# Altium project MCH_MAIN.PrjPcb (part 3 of 3)

## Sheet MB_ZBT_memory.SchDoc
size A
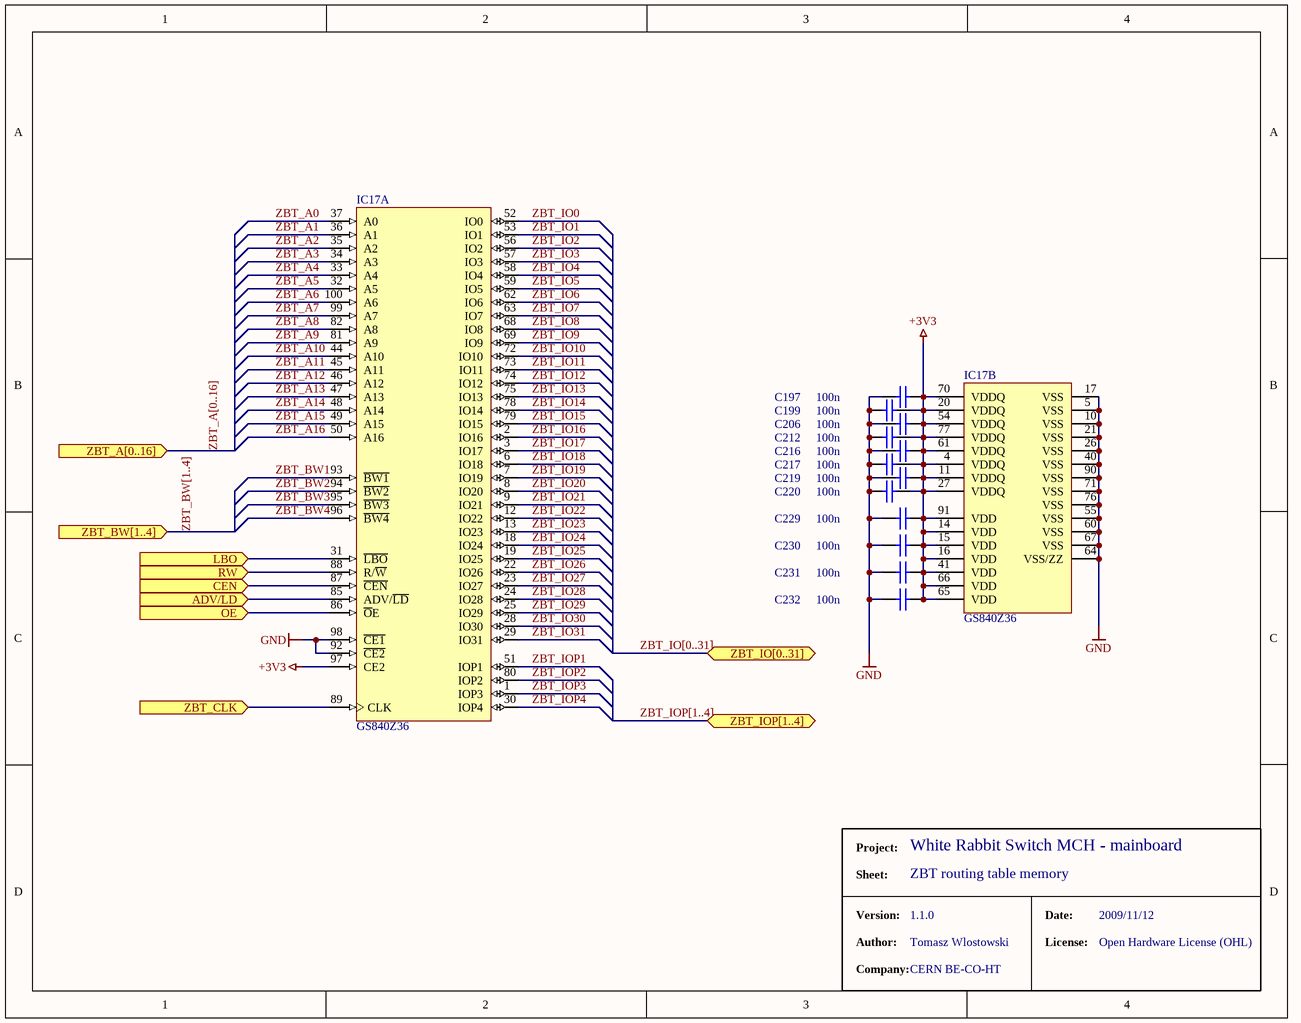
[diagram p7: MB_ZBT_memory.SchDoc]

### Parts
C197  100n  [CAPC1005X55N]
C199  100n  [CAPC1005X55N]
C206  100n  [CAPC1005X55N]
C212  100n  [CAPC1005X55N]
C216  100n  [CAPC1005X55N]
C217  100n  [CAPC1005X55N]
C219  100n  [CAPC1005X55N]
C220  100n  [CAPC1005X55N]
C229  100n  [CAPC1005X55N]
C230  100n  [CAPC1005X55N]
C231  100n  [CAPC1005X55N]
C232  100n  [CAPC1005X55N]
IC17  GS840Z36  [TQFP100A101]  (parts A,B of 2)

### Ports
ADV/LD (in), CEN (in), LBO (in), OE (in), RW (in), ZBT_A[0..16] (in), ZBT_BW[1..4] (in), ZBT_CLK (in), ZBT_IO[0..31] (bidir), ZBT_IOP[1..4] (bidir)

### Nets
+3V3: C197.2 C199.2 C206.2 C212.2 C216.2 C217.2 C219.2 C220.2 C229.2 C230.2 C231.2 C232.2 IC17.4(VDDQ) IC17.11(VDDQ) IC17.14(VDD) IC17.15(VDD) IC17.16(VDD) IC17.20(VDDQ) IC17.27(VDDQ) IC17.41(VDD) IC17.54(VDDQ) IC17.61(VDDQ) IC17.65(VDD) IC17.66(VDD) IC17.70(VDDQ) IC17.77(VDDQ) IC17.91(VDD) IC17.97(CE2)
GND: C197.1 C199.1 C206.1 C212.1 C216.1 C217.1 C219.1 C220.1 C229.1 C230.1 C231.1 C232.1 IC17.5(VSS) IC17.10(VSS) IC17.17(VSS) IC17.21(VSS) IC17.26(VSS) IC17.40(VSS) IC17.55(VSS) IC17.60(VSS) IC17.64(VSS/ZZ) IC17.67(VSS) IC17.71(VSS) IC17.76(VSS) IC17.90(VSS) IC17.92(~{CE2}) IC17.98(~{CE1})
ZBT_A0: IC17.37(A0)
ZBT_A1: IC17.36(A1)
ZBT_A2: IC17.35(A2)
ZBT_A3: IC17.34(A3)
ZBT_A4: IC17.33(A4)
ZBT_A5: IC17.32(A5)
ZBT_A6: IC17.100(A6)
ZBT_A7: IC17.99(A7)
ZBT_A8: IC17.82(A8)
ZBT_A9: IC17.81(A9)
ZBT_A10: IC17.44(A10)
ZBT_A11: IC17.45(A11)
ZBT_A12: IC17.46(A12)
ZBT_A13: IC17.47(A13)
ZBT_A14: IC17.48(A14)
ZBT_A15: IC17.49(A15)
ZBT_A16: IC17.50(A16)
ZBT_BW1: IC17.93(~{BW1})
ZBT_BW2: IC17.94(~{BW2})
ZBT_BW3: IC17.95(~{BW3})
ZBT_BW4: IC17.96(~{BW4})
ZBT_IO0: IC17.52(IO0)
ZBT_IO1: IC17.53(IO1)
ZBT_IO2: IC17.56(IO2)
ZBT_IO3: IC17.57(IO3)
ZBT_IO4: IC17.58(IO4)
ZBT_IO5: IC17.59(IO5)
ZBT_IO6: IC17.62(IO6)
ZBT_IO7: IC17.63(IO7)
ZBT_IO8: IC17.68(IO8)
ZBT_IO9: IC17.69(IO9)
ZBT_IO10: IC17.72(IO10)
ZBT_IO11: IC17.73(IO11)
ZBT_IO12: IC17.74(IO12)
ZBT_IO13: IC17.75(IO13)
ZBT_IO14: IC17.78(IO14)
ZBT_IO15: IC17.79(IO15)
ZBT_IO16: IC17.2(IO16)
ZBT_IO17: IC17.3(IO17)
ZBT_IO18: IC17.6(IO18)
ZBT_IO19: IC17.7(IO19)
ZBT_IO20: IC17.8(IO20)
ZBT_IO21: IC17.9(IO21)
ZBT_IO22: IC17.12(IO22)
ZBT_IO23: IC17.13(IO23)
ZBT_IO24: IC17.18(IO24)
ZBT_IO25: IC17.19(IO25)
ZBT_IO26: IC17.22(IO26)
ZBT_IO27: IC17.23(IO27)
ZBT_IO28: IC17.24(IO28)
ZBT_IO29: IC17.25(IO29)
ZBT_IO30: IC17.28(IO30)
ZBT_IO31: IC17.29(IO31)
ZBT_IOP1: IC17.51(IOP1)
ZBT_IOP2: IC17.80(IOP2)
ZBT_IOP3: IC17.1(IOP3)
ZBT_IOP4: IC17.30(IOP4)
NetIC17_31: IC17.31(~{LBO}) ; port LBO
NetIC17_85: IC17.85(ADV/~{LD}) ; port ADV/LD
NetIC17_86: IC17.86(~{O}E) ; port OE
NetIC17_87: IC17.87(~{CEN}) ; port CEN
NetIC17_88: IC17.88(R/~{W}) ; port RW
NetIC17_89: IC17.89(CLK) ; port ZBT_CLK

### Buses and harness runs
bus ZBT_A[0..16] = port ZBT_A[0..16]
bus ZBT_BW[1..4] = port ZBT_BW[1..4]
bus ZBT_IO[0..31] = port ZBT_IO[0..31]
bus ZBT_IOP[1..4] = port ZBT_IOP[1..4]

### Notes on the sheet
- Project:
- Sheet:
- ZBT routing table memory
- White Rabbit Switch MCH - mainboard
- Version:
- Author:
- Company:
- 1.1.0
- Tomasz Wlostowski
- CERN BE-CO-HT
- Date:
- License:
- 2009/11/12
- Open Hardware License (OHL)

### Library data of the parts
C197 C199 C206 C212 C216 C217 C219 C220 C229-C232 = CC0402_100NF_16V_10%_X7R: Non-polarised capacitor; Part Description: SMD Multilayer Chip Ceramic Capacitor; Manufacturer: GENERIC; Manufacturer1 Part Number: 223878715649; Manufacturer1 Datasheet: \\cern.ch\dfs\Applications\Altium\Datasheets\CC0402_X7R_PHYCOMP.pdf; Value: 100nF; Voltage: 16V; TC: X7R; Tolerance: ±10%; Table: Capacitors SMD; Part Number: CC0402_100NF_16V_10%_X7R; Component Kind: Standard; Component Type: Standard; Designator: Capacitor - non polarized; Library Reference: Capacitor - non polarized; Pin Count: 2; Status: Not Recommended; Manufacturer Part Number: CC0402_100NF_16V_10%_X7R; Case: 0402; Mounted: Yes; Socket: No; SMD: Yes; Manufacturer1 Example: PHYCOMP; Manufacturer1 ComponentHeight: 0.55mm; HelpURL: \\cern.ch\dfs\Applications\Altium\Datasheets\CC0402_X7R_PHYCOMP.pdf; Author: CERN DEM JLC; CreateDate: 12/3/2007; LatestRevisionDate: 12/3/2007
IC17 = 71V3556: 4.5 Mbit ZBT SRAM; RefId: 800-1843-1-ND; Value: IDT71V3556S166PFG8; Supplier: Digikey

## Sheet MB_fpga_power.SchDoc
size A3
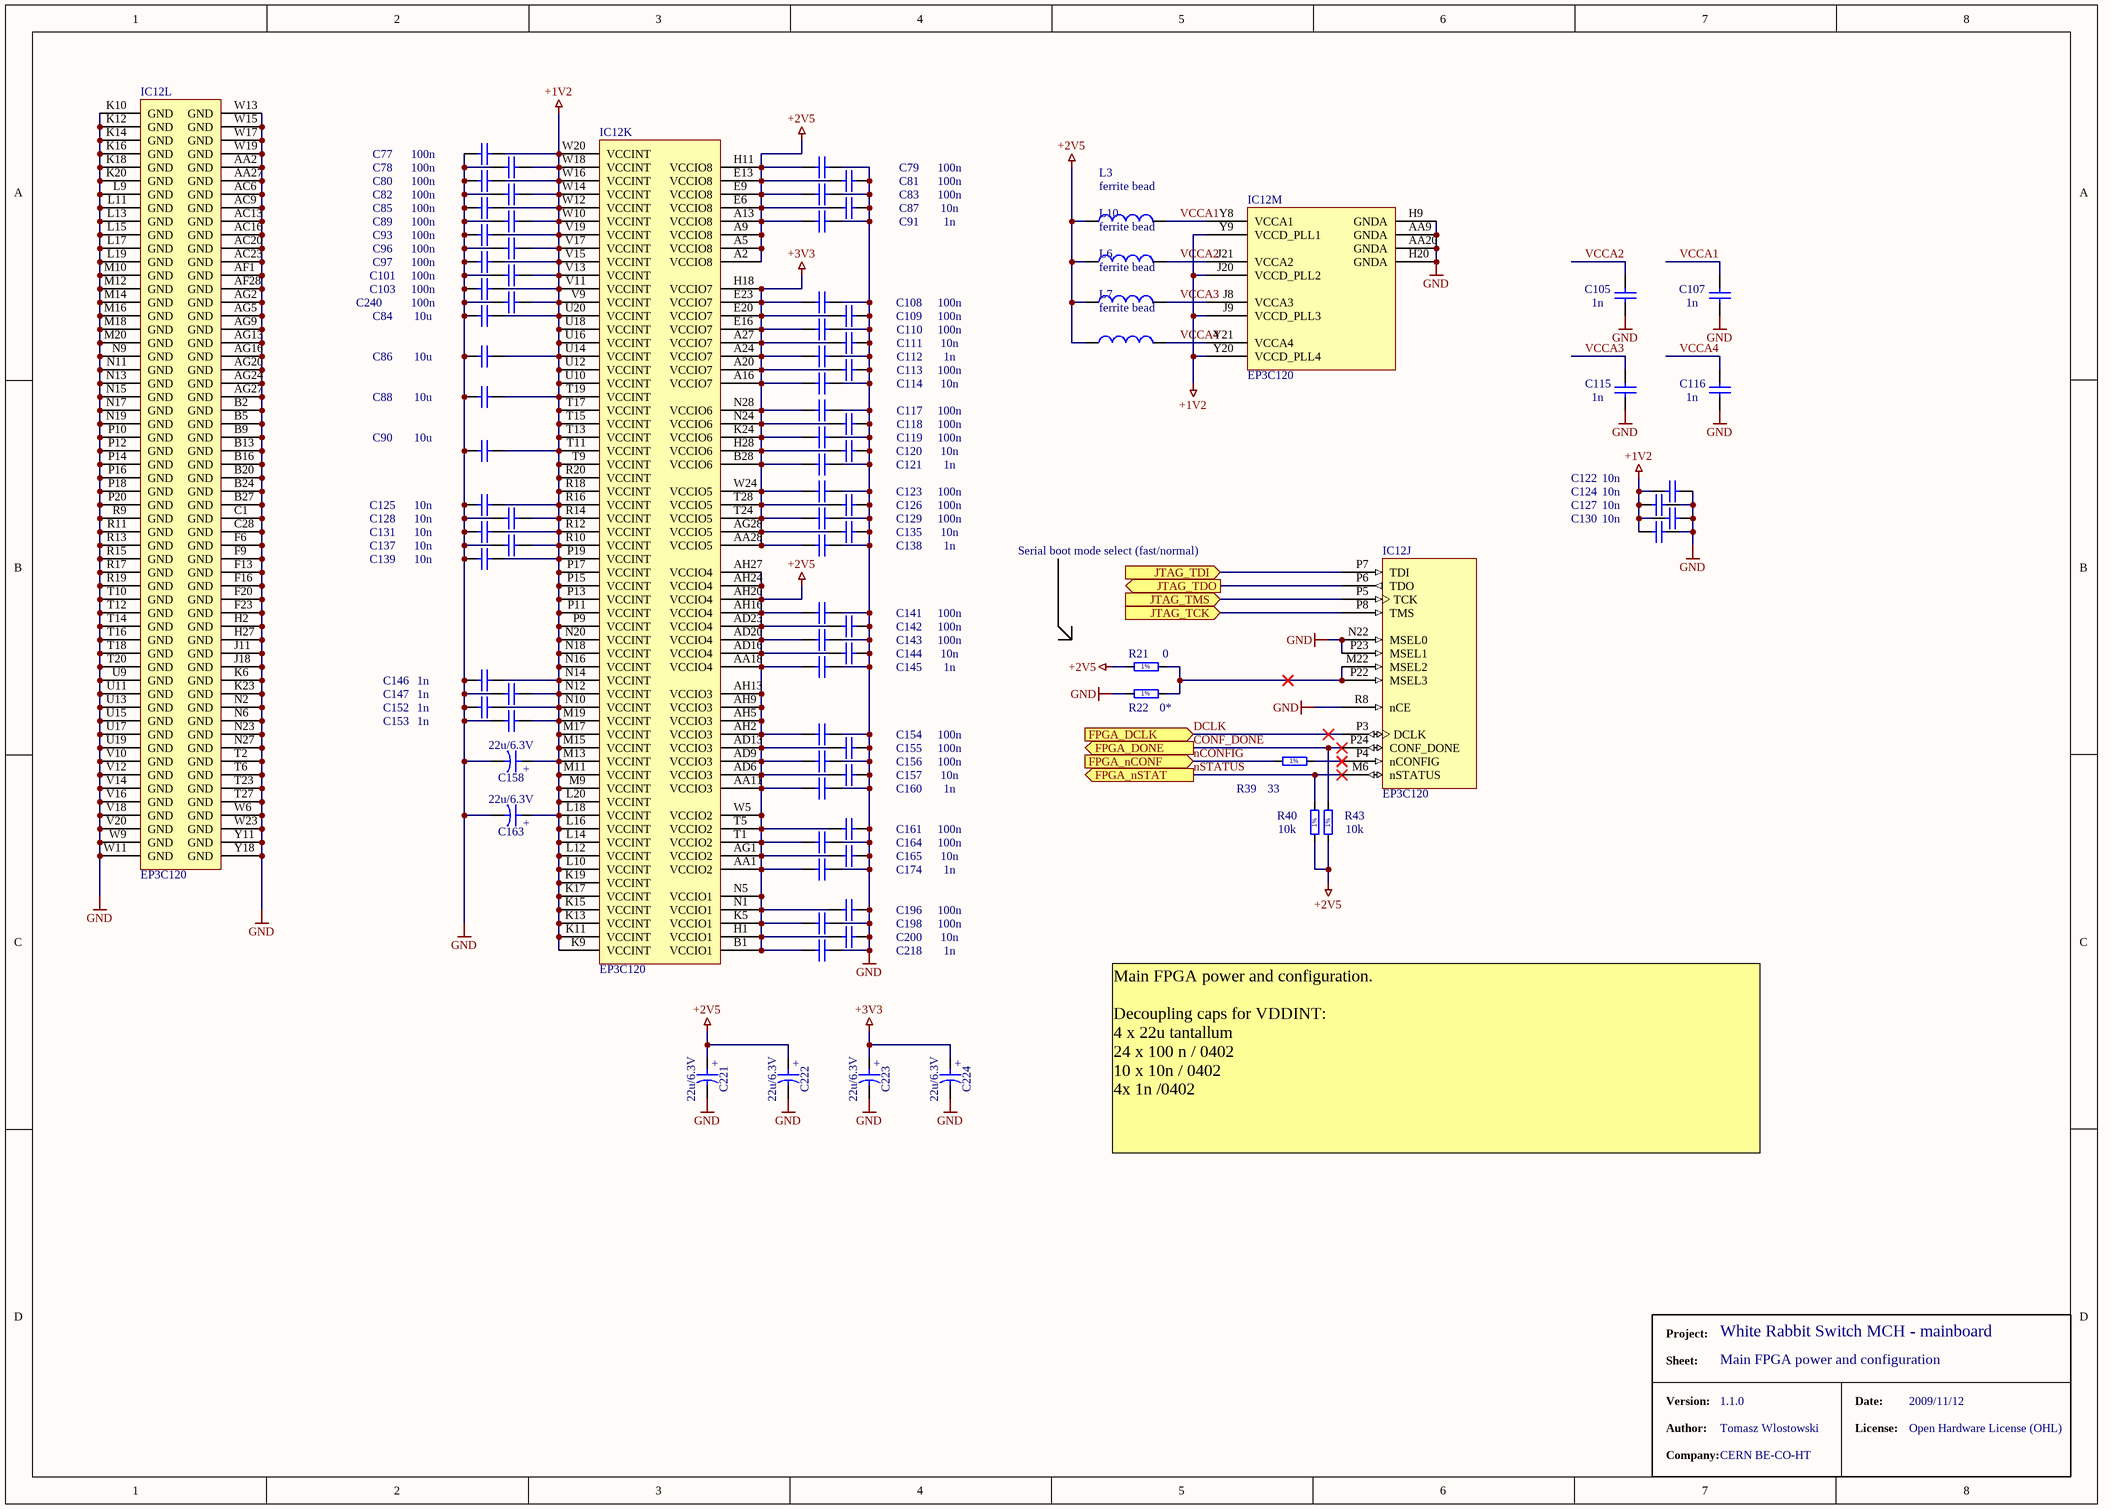
[diagram p8: MB_fpga_power.SchDoc]

### Parts
C77  100n  [CAPC1005X55N]
C78  100n  [CAPC1005X55N]
C79  100n  [CAPC1005X55N]
C80  100n  [CAPC1005X55N]
C81  100n  [CAPC1005X55N]
C82  100n  [CAPC1005X55N]
C83  100n  [CAPC1005X55N]
C84  10u  [CAPC2012X135N]
C85  100n  [CAPC1005X55N]
C86  10u  [CAPC2012X135N]
C87  10n  [CAPC1005X55N]
C88  10u  [CAPC2012X135N]
C89  100n  [CAPC1005X55N]
C90  10u  [CAPC2012X135N]
C91  1n  [CAPC1005X55N]
C93  100n  [CAPC1005X55N]
C96  100n  [CAPC1005X55N]
C97  100n  [CAPC1005X55N]
C101  100n  [CAPC1005X55N]
C103  100n  [CAPC1005X55N]
C105  1n  [CAPC1005X55N]
C107  1n  [CAPC1005X55N]
C108  100n  [CAPC1005X55N]
C109  100n  [CAPC1005X55N]
C110  100n  [CAPC1005X55N]
C111  10n  [CAPC1005X55N]
C112  1n  [CAPC1005X55N]
C113  100n  [CAPC1005X55N]
C114  10n  [CAPC1005X55N]
C115  1n  [CAPC1005X55N]
C116  1n  [CAPC1005X55N]
C117  100n  [CAPC1005X55N]
C118  100n  [CAPC1005X55N]
C119  100n  [CAPC1005X55N]
C120  10n  [CAPC1005X55N]
C121  1n  [CAPC1005X55N]
C122  10n  [CAPC1005X55N]
C123  100n  [CAPC1005X55N]
C124  10n  [CAPC1005X55N]
C125  10n  [CAPC1005X55N]
C126  100n  [CAPC1005X55N]
C127  10n  [CAPC1005X55N]
C128  10n  [CAPC1005X55N]
C129  100n  [CAPC1005X55N]
C130  10n  [CAPC1005X55N]
C131  10n  [CAPC1005X55N]
C135  10n  [CAPC1005X55N]
C137  10n  [CAPC1005X55N]
C138  1n  [CAPC1005X55N]
C139  10n  [CAPC1005X55N]
C141  100n  [CAPC1005X55N]
C142  100n  [CAPC1005X55N]
C143  100n  [CAPC1005X55N]
C144  10n  [CAPC1005X55N]
C145  1n  [CAPC1005X55N]
C146  1n  [CAPC1005X55N]
C147  1n  [CAPC1005X55N]
C152  1n  [CAPC1005X55N]
C153  1n  [CAPC1005X55N]
C154  100n  [CAPC1005X55N]
C155  100n  [CAPC1005X55N]
C156  100n  [CAPC1005X55N]
C157  10n  [CAPC1005X55N]
C158  22u/6.3V  [CAPMP3216X180N]
C160  1n  [CAPC1005X55N]
C161  100n  [CAPC1005X55N]
C163  22u/6.3V  [CAPMP3216X180N]
C164  100n  [CAPC1005X55N]
C165  10n  [CAPC1005X55N]
C174  1n  [CAPC1005X55N]
C196  100n  [CAPC1005X55N]
C198  100n  [CAPC1005X55N]
C200  10n  [CAPC1005X55N]
C218  1n  [CAPC1005X55N]
C221  22u/6.3V  [CAPMP3216X180N]
C222  22u/6.3V  [CAPMP3216X180N]
C223  22u/6.3V  [CAPMP3216X180N]
C224  22u/6.3V  [CAPMP3216X180N]
C240  100n  [CAPC1005X55N]
IC12  EP3C120  [FBGA780-2]  (parts J,K,L,M of 13)
L3  value ferrite bead  [INDC1005-0402]  (hidden comment: Inductor)
L6  value ferrite bead  [INDC1005-0402]  (hidden comment: Inductor)
L7  value ferrite bead  [INDC1005-0402]  (hidden comment: Inductor)
L10  value ferrite bead  [INDC1005-0402]  (hidden comment: Inductor)
R21  0  [RESC1005X40N]
R22  0*  [RESC1005X40N]
R39  33  [RESC1005X40N]
R40  10k  [RESC1005X40N]
R43  10k  [RESC1005X40N]

### Ports
FPGA_DCLK (in), FPGA_DONE (out), FPGA_nCONF (in), FPGA_nSTAT (out), JTAG_TCK (in), JTAG_TDI (in), JTAG_TDO (out), JTAG_TMS (in)

### Nets
+1V2: C77.2 C78.2 C80.2 C82.2 C84.2 C85.2 C86.2 C88.2 C89.2 C90.2 C93.2 C96.2 C97.2 C101.2 C103.2 C122.1 C124.1 C125.1 C127.1 C128.1 C130.1 C131.1 C137.1 C139.1 C146.1 C147.1 C152.1 C153.1 C158.1 C163.1 C240.2 IC12.J9(VCCD_PLL3) IC12.J20(VCCD_PLL2) IC12.K9(VCCINT) IC12.K11(VCCINT) IC12.K13(VCCINT) IC12.K15(VCCINT) IC12.K17(VCCINT) IC12.K19(VCCINT) IC12.L10(VCCINT) IC12.L12(VCCINT) IC12.L14(VCCINT) IC12.L16(VCCINT) IC12.L18(VCCINT) IC12.L20(VCCINT) IC12.M9(VCCINT) IC12.M11(VCCINT) IC12.M13(VCCINT) IC12.M15(VCCINT) IC12.M17(VCCINT) IC12.M19(VCCINT) IC12.N10(VCCINT) IC12.N12(VCCINT) IC12.N14(VCCINT) IC12.N16(VCCINT) IC12.N18(VCCINT) IC12.N20(VCCINT) IC12.P9(VCCINT) IC12.P11(VCCINT) IC12.P13(VCCINT) IC12.P15(VCCINT) IC12.P17(VCCINT) IC12.P19(VCCINT) IC12.R10(VCCINT) IC12.R12(VCCINT) IC12.R14(VCCINT) IC12.R16(VCCINT) IC12.R18(VCCINT) IC12.R20(VCCINT) IC12.T9(VCCINT) IC12.T11(VCCINT) IC12.T13(VCCINT) IC12.T15(VCCINT) IC12.T17(VCCINT) IC12.T19(VCCINT) IC12.U10(VCCINT) IC12.U12(VCCINT) IC12.U14(VCCINT) IC12.U16(VCCINT) IC12.U18(VCCINT) IC12.U20(VCCINT) IC12.V9(VCCINT) IC12.V11(VCCINT) IC12.V13(VCCINT) IC12.V15(VCCINT) IC12.V17(VCCINT) IC12.V19(VCCINT) IC12.W10(VCCINT) IC12.W12(VCCINT) IC12.W14(VCCINT) IC12.W16(VCCINT) IC12.W18(VCCINT) IC12.W20(VCCINT) IC12.Y9(VCCD_PLL1) IC12.Y20(VCCD_PLL4)
+2V5: C79.1 C81.1 C83.1 C87.1 C91.1 C141.1 C142.1 C143.1 C144.1 C145.1 C154.1 C155.1 C156.1 C157.1 C160.1 C161.1 C164.1 C165.1 C174.1 C196.1 C198.1 C200.1 C218.1 C221.1 C222.1 IC12.A2(VCCIO8) IC12.A5(VCCIO8) IC12.A9(VCCIO8) IC12.A13(VCCIO8) IC12.AA1(VCCIO2) IC12.AA11(VCCIO3) IC12.AA18(VCCIO4) IC12.AD6(VCCIO3) IC12.AD9(VCCIO3) IC12.AD13(VCCIO3) IC12.AD16(VCCIO4) IC12.AD20(VCCIO4) IC12.AD23(VCCIO4) IC12.AG1(VCCIO2) IC12.AH2(VCCIO3) IC12.AH5(VCCIO3) IC12.AH9(VCCIO3) IC12.AH13(VCCIO3) IC12.AH16(VCCIO4) IC12.AH20(VCCIO4) IC12.AH24(VCCIO4) IC12.AH27(VCCIO4) IC12.B1(VCCIO1) IC12.E6(VCCIO8) IC12.E9(VCCIO8) IC12.E13(VCCIO8) IC12.H1(VCCIO1) IC12.H11(VCCIO8) IC12.K5(VCCIO1) IC12.N1(VCCIO1) IC12.N5(VCCIO1) IC12.T1(VCCIO2) IC12.T5(VCCIO2) IC12.W5(VCCIO2) L3.1 L6.1 L7.1 L10.1 R21.1 R40.1 R43.1
+3V3: C108.1 C109.1 C110.1 C111.1 C112.1 C113.1 C114.1 C117.1 C118.1 C119.1 C120.1 C121.1 C123.1 C126.1 C129.1 C135.1 C138.1 C223.1 C224.1 IC12.A16(VCCIO7) IC12.A20(VCCIO7) IC12.A24(VCCIO7) IC12.A27(VCCIO7) IC12.AA28(VCCIO5) IC12.AG28(VCCIO5) IC12.B28(VCCIO6) IC12.E16(VCCIO7) IC12.E20(VCCIO7) IC12.E23(VCCIO7) IC12.H18(VCCIO7) IC12.H28(VCCIO6) IC12.K24(VCCIO6) IC12.N24(VCCIO6) IC12.N28(VCCIO6) IC12.T24(VCCIO5) IC12.T28(VCCIO5) IC12.W24(VCCIO5)
GND: C77.1 C78.1 C79.2 C80.1 C81.2 C82.1 C83.2 C84.1 C85.1 C86.1 C87.2 C88.1 C89.1 C90.1 C91.2 C93.1 C96.1 C97.1 C101.1 C103.1 C105.1 C107.1 C108.2 C109.2 C110.2 C111.2 C112.2 C113.2 C114.2 C115.1 C116.1 C117.2 C118.2 C119.2 C120.2 C121.2 C122.2 C123.2 C124.2 C125.2 C126.2 C127.2 C128.2 C129.2 C130.2 C131.2 C135.2 C137.2 C138.2 C139.2 C141.2 C142.2 C143.2 C144.2 C145.2 C146.2 C147.2 C152.2 C153.2 C154.2 C155.2 C156.2 C157.2 C158.2 C160.2 C161.2 C163.2 C164.2 C165.2 C174.2 C196.2 C198.2 C200.2 C218.2 C221.2 C222.2 C223.2 C224.2 C240.1 IC12.AA2(GND) IC12.AA9(GNDA) IC12.AA20(GNDA) IC12.AA27(GND) IC12.AC6(GND) IC12.AC9(GND) IC12.AC13(GND) IC12.AC16(GND) IC12.AC20(GND) IC12.AC23(GND) IC12.AF1(GND) IC12.AF28(GND) IC12.AG2(GND) IC12.AG5(GND) IC12.AG9(GND) IC12.AG13(GND) IC12.AG16(GND) IC12.AG20(GND) IC12.AG24(GND) IC12.AG27(GND) IC12.B2(GND) IC12.B5(GND) IC12.B9(GND) IC12.B13(GND) IC12.B16(GND) IC12.B20(GND) IC12.B24(GND) IC12.B27(GND) IC12.C1(GND) IC12.C28(GND) IC12.F6(GND) IC12.F9(GND) IC12.F13(GND) IC12.F16(GND) IC12.F20(GND) IC12.F23(GND) IC12.H2(GND) IC12.H9(GNDA) IC12.H20(GNDA) IC12.H27(GND) IC12.J11(GND) IC12.J18(GND) IC12.K6(GND) IC12.K10(GND) IC12.K12(GND) IC12.K14(GND) IC12.K16(GND) IC12.K18(GND) IC12.K20(GND) IC12.K23(GND) IC12.L9(GND) IC12.L11(GND) IC12.L13(GND) IC12.L15(GND) IC12.L17(GND) IC12.L19(GND) IC12.M10(GND) IC12.M12(GND) IC12.M14(GND) IC12.M16(GND) IC12.M18(GND) IC12.M20(GND) IC12.N2(GND) IC12.N6(GND) IC12.N9(GND) IC12.N11(GND) IC12.N13(GND) IC12.N15(GND) IC12.N17(GND) IC12.N19(GND) IC12.N22(MSEL0) IC12.N23(GND) IC12.N27(GND) IC12.P10(GND) IC12.P12(GND) IC12.P14(GND) IC12.P16(GND) IC12.P18(GND) IC12.P20(GND) IC12.P23(MSEL1) IC12.R8(nCE) IC12.R9(GND) IC12.R11(GND) IC12.R13(GND) IC12.R15(GND) IC12.R17(GND) IC12.R19(GND) IC12.T2(GND) IC12.T6(GND) IC12.T10(GND) IC12.T12(GND) IC12.T14(GND) IC12.T16(GND) IC12.T18(GND) IC12.T20(GND) IC12.T23(GND) IC12.T27(GND) IC12.U9(GND) IC12.U11(GND) IC12.U13(GND) IC12.U15(GND) IC12.U17(GND) IC12.U19(GND) IC12.V10(GND) IC12.V12(GND) IC12.V14(GND) IC12.V16(GND) IC12.V18(GND) IC12.V20(GND) IC12.W6(GND) IC12.W9(GND) IC12.W11(GND) IC12.W13(GND) IC12.W15(GND) IC12.W17(GND) IC12.W19(GND) IC12.W23(GND) IC12.Y11(GND) IC12.Y18(GND) R22.1
CONF_DONE: IC12.P24(CONF_DONE) R43.2 ; port FPGA_DONE
DCLK: IC12.P3(DCLK) ; port FPGA_DCLK
nCONFIG: R39.1 ; port FPGA_nCONF
nSTATUS: IC12.M6(nSTATUS) R40.2 ; port FPGA_nSTAT
VCCA1: C107.2 IC12.Y8(VCCA1) L3.2
VCCA2: C105.2 IC12.J21(VCCA2) L10.2
VCCA3: C115.2 IC12.J8(VCCA3) L6.2
VCCA4: C116.2 IC12.Y21(VCCA4) L7.2
NetIC12_M22: IC12.M22(MSEL2) IC12.P22(MSEL3) R21.2 R22.2
NetIC12_P4: IC12.P4(nCONFIG) R39.2
NetIC12_P5: IC12.P5(TCK) ; port JTAG_TMS
NetIC12_P6: IC12.P6(TDO) ; port JTAG_TDO
NetIC12_P7: IC12.P7(TDI) ; port JTAG_TDI
NetIC12_P8: IC12.P8(TMS) ; port JTAG_TCK

### Notes on the sheet
- Serial boot mode select (fast/normal)
- Main FPGA power and configuration.
  Decoupling caps for VDDINT:
  4 x 22u tantallum
  24 x 100 n / 0402
  10 x 10n / 0402
  4x 1n /0402
- Project:
- Sheet:
- Main FPGA power and configuration
- White Rabbit Switch MCH - mainboard
- Version:
- Author:
- Company:
- 1.1.0
- Tomasz Wlostowski
- CERN BE-CO-HT
- Date:
- License:
- 2009/11/12
- Open Hardware License (OHL)
- (in symbol CTE3216-18_22UF_6.3V_10%_LESR0900) +
- (in symbol R0402_0R_JUMPER) 1%
- (in symbol R0402_10K_1%_0.0625W_100PPM) 1%
- (in symbol R0402_33R_1%_0.0625W_100PPM) 1%

### Library data of the parts
C77-C83 C85 C89 C93 C96 C97 C101 C103 C108-C110 C113 C117-C119 C123 C126 C129 C141-C143 C154-C156 C161 C164 C196 C198 C240 = CC0402_100NF_16V_10%_X7R: Non-polarised capacitor; Part Description: SMD Multilayer Chip Ceramic Capacitor; Manufacturer: GENERIC; Manufacturer1 Part Number: 223878715649; Manufacturer1 Datasheet: \\cern.ch\dfs\Applications\Altium\Datasheets\CC0402_X7R_PHYCOMP.pdf; Value: 100nF; Voltage: 16V; TC: X7R; Tolerance: ±10%; Table: Capacitors SMD; Part Number: CC0402_100NF_16V_10%_X7R; Component Kind: Standard; Component Type: Standard; Designator: Capacitor - non polarized; Library Reference: Capacitor - non polarized; Pin Count: 2; Status: Not Recommended; Manufacturer Part Number: CC0402_100NF_16V_10%_X7R; Case: 0402; Mounted: Yes; Socket: No; SMD: Yes; Manufacturer1 Example: PHYCOMP; Manufacturer1 ComponentHeight: 0.55mm; HelpURL: \\cern.ch\dfs\Applications\Altium\Datasheets\CC0402_X7R_PHYCOMP.pdf; Author: CERN DEM JLC; CreateDate: 12/3/2007; LatestRevisionDate: 12/3/2007
C84 C86 C88 C90 = CC0805_10uF_16V_10%_X5R: Non-polarised capacitor; Part Description: SMD Multilayer Chip Ceramic Capacitor; Manufacturer: GENERIC; Manufacturer1 Part Number: C0805C106K4PAC; Manufacturer1 Datasheet: \\cern.ch\dfs\Applications\Altium\Datasheets\CC1206_X5R_KEMET.pdf; Value: 10uF; Voltage: 16V; TC: X5R; Tolerance: ±10%; Table: Capacitors SMD; Part Number: CC0805_10uF_16V_10%_X5R; Component Kind: Standard; Component Type: Standard; Designator: Capacitor - non polarized; Library Reference: Capacitor - non polarized; Pin Count: 2; Status: Preferred; Manufacturer Part Number: CC0805_10uF_16V_±10%_X5R; Case: 0805; Mounted: Yes; Socket: No; SMD: Yes; Manufacturer1 Example: KEMET; Manufacturer1 ComponentHeight: 1.4mm; HelpURL: \\cern.ch\dfs\Applications\Altium\Datasheets\CC1206_X5R_KEMET.pdf; Author: CERN DEM JLC; CreateDate: 12/3/2007; LatestRevisionDate: 12/3/2007
C87 C111 C114 C120 C122 C124 C125 C127 C128 C130 C131 C135 C137 C139 C144 C157 C165 C200 = CC0402_10NF_16V_10%_X7R: Non-polarised capacitor; Part Description: SMD Multilayer Chip Ceramic Capacitor; Manufacturer: GENERIC; Manufacturer1 Part Number: 223878715636; Manufacturer1 Datasheet: \\cern.ch\dfs\Applications\Altium\Datasheets\CC0402_X7R_PHYCOMP.pdf; Value: 10nF; Voltage: 16V; TC: X7R; Tolerance: ±10%; Table: Capacitors SMD; Part Number: CC0402_10NF_16V_10%_X7R; Component Kind: Standard; Component Type: Standard; Designator: Capacitor - non polarized; Library Reference: Capacitor - non polarized; Pin Count: 2; Status: Not Recommended; Manufacturer Part Number: CC0402_10NF_16V_10%_X7R; Case: 0402; Mounted: Yes; Socket: No; SMD: Yes; Manufacturer1 Example: PHYCOMP; Manufacturer1 ComponentHeight: 0.55mm; HelpURL: \\cern.ch\dfs\Applications\Altium\Datasheets\CC0402_X7R_PHYCOMP.pdf; Author: CERN DEM JLC; CreateDate: 12/3/2007; LatestRevisionDate: 12/3/2007
C91 C105 C107 C112 C115 C116 C121 C138 C145-C147 C152 C153 C160 C174 C218 = CC0402_1.0NF_50V_10%_X7R: Non-polarised capacitor; Part Description: SMD Multilayer Chip Ceramic Capacitor; Manufacturer: GENERIC; Manufacturer1 Part Number: 223858715623; Manufacturer1 Datasheet: \\cern.ch\dfs\Applications\Altium\Datasheets\CC0402_X7R_PHYCOMP.pdf; Value: 1nF; Voltage: 50V; TC: X7R; Tolerance: ±10%; Table: Capacitors SMD; Part Number: CC0402_1.0NF_50V_10%_X7R; Component Kind: Standard; Component Type: Standard; Designator: Capacitor - non polarized; Library Reference: Capacitor - non polarized; Pin Count: 2; Status: Not Recommended; Manufacturer Part Number: CC0402_1.0NF_50V_10%_X7R; Case: 0402; Mounted: Yes; Socket: No; SMD: Yes; Manufacturer1 Example: PHYCOMP; Manufacturer1 ComponentHeight: 0.55mm; HelpURL: \\cern.ch\dfs\Applications\Altium\Datasheets\CC0402_X7R_PHYCOMP.pdf; Author: CERN DEM JLC; CreateDate: 12/3/2007; LatestRevisionDate: 12/3/2007
C158 C163 C221-C224 = CTE3216-18_22UF_6.3V_10%_LESR0900: Polarised capacitor; Part Description: Low ESR 0R9 Solid Tantalum Chip Capacitor; Manufacturer: GENERIC; Manufacturer1 Part Number: TPSA226K006R0900; Manufacturer1 Datasheet: \\cern.ch\dfs\Applications\Altium\Datasheets\CTE-LESR_AVX_TPS.pdf; Value: 22uF; Voltage: 6.3V; Tolerance: ±10%; Table: Capacitors SMD; Part Number: CTE3216-18_22UF_6.3V_10%_LESR0900; Component Kind: Standard; Component Type: Standard; Designator: Capacitor - polarized; Library Reference: Capacitor - polarized; Pin Count: 2; Status: Preferred; Manufacturer Part Number: CTE3216-18_22UF_6.3V_10%_LESR0900; Case: A; Mounted: Yes; Socket: No; SMD: Yes; Manufacturer1 Example: AVX; Manufacturer1 ComponentHeight: 1.8mm; HelpURL: \\cern.ch\dfs\Applications\Altium\Datasheets\CTE-LESR_AVX_TPS.pdf; Author: CERN DEM JLC; CreateDate: 5/5/2008; LatestRevisionDate: 1/20/2009
IC12 = EP3C120F780C7: Cyclone III Family FPGA, 531 I/O Pins, 4 PLLs, 780-Pin FBGA, Speed Grade 7, Commercial Grade; Value: EP3C120F780C8N; RefId: 1635080; Published: 26-Feb-2007; DatasheetVersion: ver1.2, Sep-2007; PackageVersion: ver14.8, Oct-2007; PackageReference: FBGA780-2; Publisher: Altium Limited; PackageDescription: 780-Ball FineLine Ball Grid Array (FBGA780) - Option 2 - Wire Bond; Code_JEDEC: MS-034-AAM-1; ComponentLink1Description: Manufacturer Link; ComponentLink1URL: http://www.altera.com/; ComponentLink2Description: Handbook (7.86MB); ComponentLink2URL: http://www.altera.com/literature/hb/cyc3/cyclone3_handbook.pdf; ComponentLink3Description: Packaging Specification; ComponentLink3URL: http://www.altera.com/literature/ds/dspkg.pdf; Supplier: Farnell
L3 L6 L7 L10 = Inductor: Ferrite bead; Published: 8-Jun-2000; Revision: July-2002: Re-released for DXP Platform.; Publisher: Altium Limited
R21 = R0402_0R_JUMPER: Resistor - 1%; Part Description: 1A (0.05R Max DC Resistance) Zero Ohm Jumper; Manufacturer: GENERIC; Manufacturer1 Part Number: 232270591001; Manufacturer1 Datasheet: \\cern.ch\dfs\Applications\Altium\Datasheets\R0402_Phycomp_RC0402.pdf; Table: Resistors SMD; Part Number: R0402_0R_JUMPER; Component Kind: Standard; Component Type: Standard; Designator: Resistor - 1%; Library Reference: Resistor - 1%; Pin Count: 2; Value: 0; Status: Not recommended; Manufacturer Part Number: R0402_0R_JUMPER; Case: 0402; Mounted: Yes; Socket: No; SMD: Yes; Manufacturer1 Example: PHYCOMP; Manufacturer1 ComponentHeight: 0.4mm; HelpURL: \\cern.ch\dfs\Applications\Altium\Datasheets\R0402_Phycomp_RC0402.pdf; Author: CERN DEM JLC; CreateDate: 12/3/2007; LatestRevisionDate: 3/13/2008
R22 = R0402_0R_JUMPER: Resistor - 1%; Part Description: 1A (0.05R Max DC Resistance) Zero Ohm Jumper; Manufacturer: GENERIC; Manufacturer1 Part Number: 232270591001; Manufacturer1 Datasheet: \\cern.ch\dfs\Applications\Altium\Datasheets\R0402_Phycomp_RC0402.pdf; Value: 0; Table: Resistors SMD; Part Number: R0402_0R_JUMPER; Component Kind: Standard; Component Type: Standard; Designator: Resistor - 1%; Library Reference: Resistor - 1%; Pin Count: 2; Status: Not recommended; Manufacturer Part Number: R0402_0R_JUMPER; Case: 0402; Mounted: Yes; Socket: No; SMD: Yes; Manufacturer1 Example: PHYCOMP; Manufacturer1 ComponentHeight: 0.4mm; HelpURL: \\cern.ch\dfs\Applications\Altium\Datasheets\R0402_Phycomp_RC0402.pdf; Author: CERN DEM JLC; CreateDate: 12/3/2007; LatestRevisionDate: 3/13/2008
R39 = R0402_33R_1%_0.0625W_100PPM: Resistor - 1%; Part Description: General Purpose Thick Film Chip Resistor; Manufacturer: GENERIC; Manufacturer1 Part Number: 232270673309; Manufacturer1 Datasheet: \\cern.ch\dfs\Applications\Altium\Datasheets\R0402_Phycomp_RC0402.pdf; TC: ±100ppm/°C; Table: Resistors SMD; Part Number: R0402_33R_1%_0.0625W_100PPM; Component Kind: Standard; Component Type: Standard; Designator: Resistor - 1%; Library Reference: Resistor - 1%; Pin Count: 2; Value: 33; Status: Not recommended; Power: 0.0625W; Tolerance: ±1%; Manufacturer Part Number: R0402_33R_1%_0.0625W_100PPM; Case: 0402; Mounted: Yes; Socket: No; SMD: Yes; Manufacturer1 Example: PHYCOMP; Manufacturer1 ComponentHeight: 0.4mm; HelpURL: \\cern.ch\dfs\Applications\Altium\Datasheets\R0402_Phycomp_RC0402.pdf; Author: CERN DEM JLC; CreateDate: 12/3/2007; LatestRevisionDate: 3/13/2008
R40 R43 = R0402_10K_1%_0.0625W_100PPM: Resistor - 1%; Part Description: General Purpose Thick Film Chip Resistor; Manufacturer: GENERIC; Manufacturer1 Part Number: 232270671003; Manufacturer1 Datasheet: \\cern.ch\dfs\Applications\Altium\Datasheets\R0402_Phycomp_RC0402.pdf; TC: ±100ppm/°C; Table: Resistors SMD; Part Number: R0402_10K_1%_0.0625W_100PPM; Component Kind: Standard; Component Type: Standard; Designator: Resistor - 1%; Library Reference: Resistor - 1%; Pin Count: 2; Value: 10k; Status: Not recommended; Power: 0.0625W; Tolerance: ±1%; Manufacturer Part Number: R0402_10K_1%_0.0625W_100PPM; Case: 0402; Mounted: Yes; Socket: No; SMD: Yes; Manufacturer1 Example: PHYCOMP; Manufacturer1 ComponentHeight: 0.4mm; HelpURL: \\cern.ch\dfs\Applications\Altium\Datasheets\R0402_Phycomp_RC0402.pdf; Author: CERN DEM JLC; CreateDate: 12/3/2007; LatestRevisionDate: 3/13/2008

## Sheet MB_downlink_phy.SchDoc
size A4
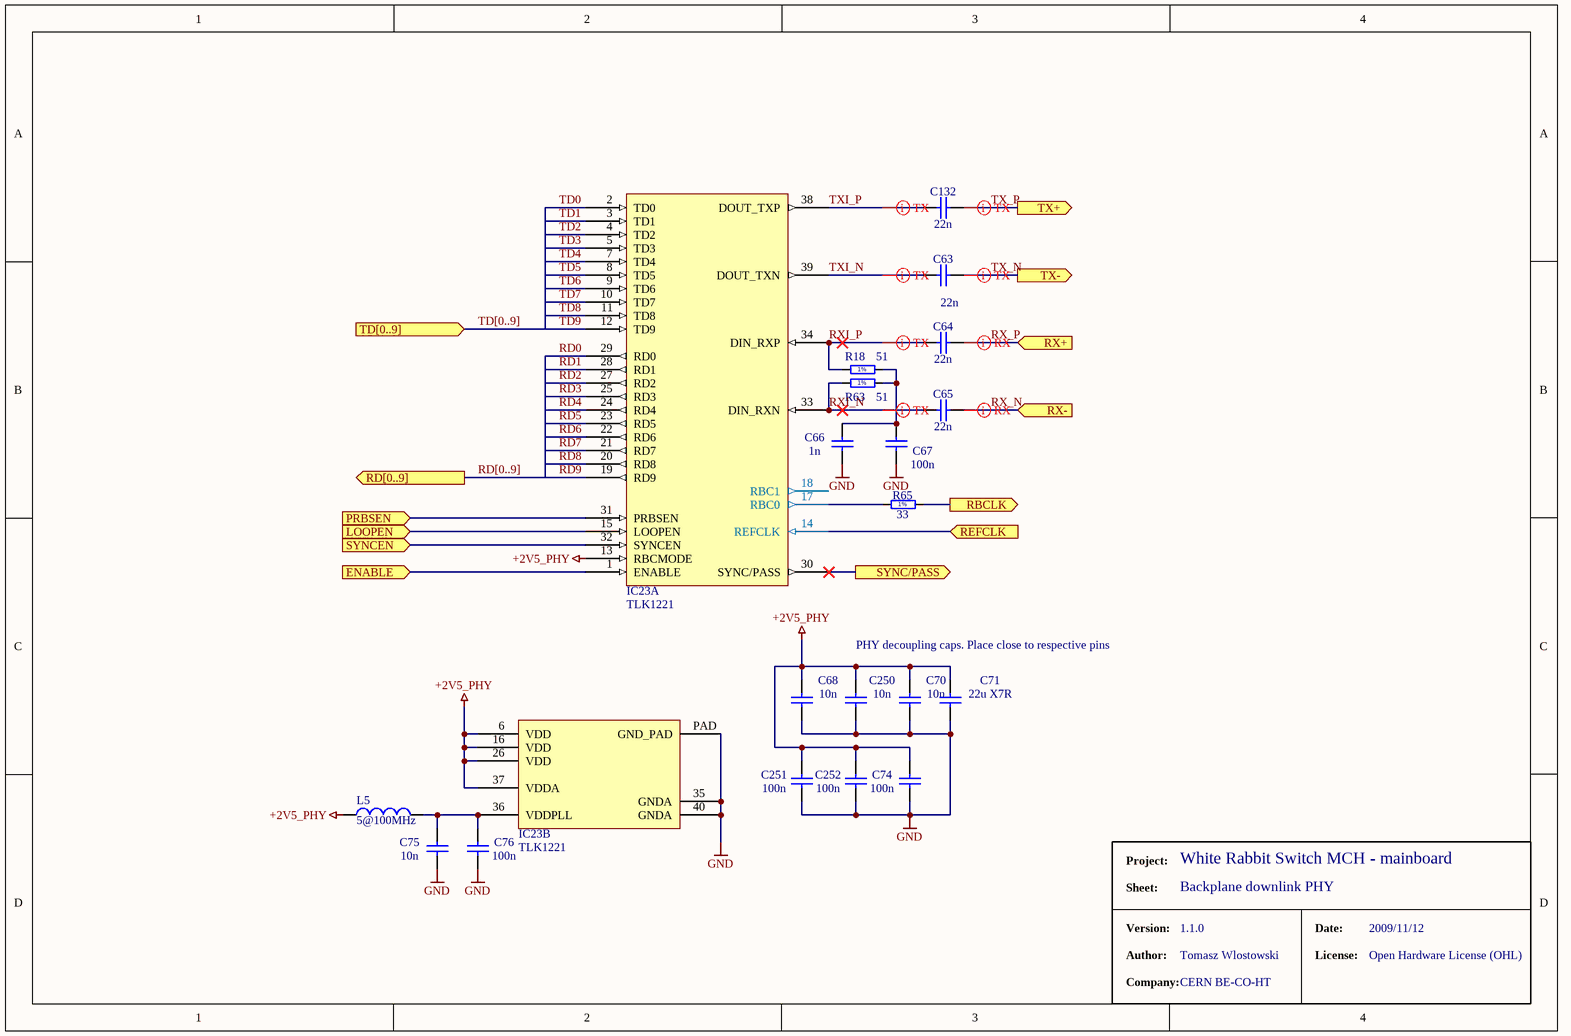
[diagram p9: MB_downlink_phy.SchDoc]

### Parts
C63  22n  [CAPC1005X55N]
C64  22n  [CAPC1005X55N]
C65  22n  [CAPC1005X55N]
C66  1n  [CAPC1005X55N]
C67  100n  [CAPC1005X55N]
C68  10n  [CAPC1005X55N]
C70  10n  [CAPC1005X55N]
C71  22u X7R  [CAPC2012X135N]
C74  100n  [CAPC1005X55N]
C75  10n  [CAPC1005X55N]
C76  100n  [CAPC1005X55N]
C132  22n  [CAPC1005X55N]
C250  10n  [CAPC1005X55N]
C251  100n  [CAPC1005X55N]
C252  100n  [CAPC1005X55N]
IC23  TLK1221  [QFN40_powerpad]  (parts A,B of 2)
L5  value 5@100MHz  [INDC1608-0603]  (hidden comment: Inductor)
R18  51  [RESC1005X40N]
R63  51  [RESC1005X40N]
R65  33  [RESC1005X40N]

### Ports
ENABLE (in), LOOPEN (in), PRBSEN (in), RBCLK (out), RD[0..9] (out), REFCLK (in), RX+ (in), RX- (in), SYNC/PASS (out), SYNCEN (in), TD[0..9] (in), TX+ (out), TX- (out)

### Nets
+2V5_PHY: C68.2 C70.2 C71.2 C74.2 C250.2 C251.2 C252.2 IC23.6(VDD) IC23.13(RBCMODE) IC23.16(VDD) IC23.26(VDD) IC23.37(VDDA) L5.1
GND: C66.1 C67.1 C68.1 C70.1 C71.1 C74.1 C75.1 C76.1 C250.1 C251.1 C252.1 IC23.35(GNDA) IC23.40(GNDA) IC23.PAD(GND_PAD)
RD0: IC23.29(RD0)
RD1: IC23.28(RD1)
RD2: IC23.27(RD2)
RD3: IC23.25(RD3)
RD4: IC23.24(RD4)
RD5: IC23.23(RD5)
RD6: IC23.22(RD6)
RD7: IC23.21(RD7)
RD8: IC23.20(RD8)
RD9: IC23.19(RD9)
RX_N: C65.2 ; port RX-
RX_P: C64.2 ; port RX+
RXI_N: C65.1 IC23.33(DIN_RXN) R63.1
RXI_P: C64.1 IC23.34(DIN_RXP) R18.1
TD0: IC23.2(TD0)
TD1: IC23.3(TD1)
TD2: IC23.4(TD2)
TD3: IC23.5(TD3)
TD4: IC23.7(TD4)
TD5: IC23.8(TD5)
TD6: IC23.9(TD6)
TD7: IC23.10(TD7)
TD8: IC23.11(TD8)
TD9: IC23.12(TD9)
TX_N: C63.2 ; port TX-
TX_P: C132.2 ; port TX+
TXI_N: C63.1 IC23.39(DOUT_TXN)
TXI_P: C132.1 IC23.38(DOUT_TXP)
NetC66_2: C66.2 C67.2 R18.2 R63.2
NetC75_2: C75.2 C76.2 IC23.36(VDDPLL) L5.2
NetIC23_1: IC23.1(ENABLE) ; port ENABLE
NetIC23_14: IC23.14(REFCLK) ; port REFCLK
NetIC23_15: IC23.15(LOOPEN) ; port LOOPEN
NetIC23_17: IC23.17(RBC0) R65.1
NetIC23_30: IC23.30(SYNC/PASS) ; port SYNC/PASS
NetIC23_31: IC23.31(PRBSEN) ; port PRBSEN
NetIC23_32: IC23.32(SYNCEN) ; port SYNCEN
NetR65_2: R65.2 ; port RBCLK

Not connected (* = marked no-connect by the designer): IC23 18(RBC1)

### Buses and harness runs
bus RD[0..9] = port RD[0..9]
bus TD[0..9] = port TD[0..9]

### Layout directives
differential pair: RX_N, RX_P, RXI_N, RXI_P, TX_N, TX_P, TXI_N, TXI_P

### Notes on the sheet
- PHY decoupling caps. Place close to respective pins
- Project:
- Sheet:
- Backplane downlink PHY
- White Rabbit Switch MCH - mainboard
- Version:
- Author:
- Company:
- 1.1.0
- Tomasz Wlostowski
- CERN BE-CO-HT
- Date:
- License:
- 2009/11/12
- Open Hardware License (OHL)
- (in symbol R0402_33R_1%_0.0625W_100PPM) 1%
- (in symbol R0402_51R_1%_0.0625W_100PPM) 1%

### Library data of the parts
C63-C65 C132 = CC0402_22NF_16V_10%_X7R: Non-polarised capacitor; Part Description: SMD Multilayer Chip Ceramic Capacitor; Manufacturer: GENERIC; Manufacturer1 Part Number: 223878715641; Manufacturer1 Datasheet: \\cern.ch\dfs\Applications\Altium\Datasheets\CC0402_X7R_PHYCOMP.pdf; Value: 22nF; Voltage: 16V; TC: X7R; Tolerance: ±10%; Table: Capacitors SMD; Part Number: CC0402_22NF_16V_10%_X7R; Component Kind: Standard; Component Type: Standard; Designator: Capacitor - non polarized; Library Reference: Capacitor - non polarized; Pin Count: 2; Status: Not Recommended; Manufacturer Part Number: CC0402_22NF_16V_10%_X7R; Case: 0402; Mounted: Yes; Socket: No; SMD: Yes; Manufacturer1 Example: PHYCOMP; Manufacturer1 ComponentHeight: 0.55mm; HelpURL: \\cern.ch\dfs\Applications\Altium\Datasheets\CC0402_X7R_PHYCOMP.pdf; Author: CERN DEM JLC; CreateDate: 12/3/2007; LatestRevisionDate: 12/3/2007
C66 = CC0402_1.0NF_50V_10%_X7R: as C91 on sheet MB_fpga_power; Part Number: CC0402_1.0NF_50V_10%_X7R; Component Kind: Standard; Component Type: Standard; Designator: Capacitor - non polarized; Library Reference: Capacitor - non polarized; Pin Count: 2; Status: Not Recommended; Manufacturer Part Number: CC0402_1.0NF_50V_10%_X7R; Case: 0402; Mounted: Yes; Socket: No; SMD: Yes; Manufacturer1 Example: PHYCOMP; Manufacturer1 ComponentHeight: 0.55mm; HelpURL: \\cern.ch\dfs\Applications\Altium\Datasheets\CC0402_X7R_PHYCOMP.pdf; Author: CERN DEM JLC; CreateDate: 12/3/2007; LatestRevisionDate: 12/3/2007
C67 C74 C76 C251 C252 = CC0402_100NF_16V_10%_X7R: as C77-C83 on sheet MB_fpga_power; Part Number: CC0402_100NF_16V_10%_X7R; Component Kind: Standard; Component Type: Standard; Designator: Capacitor - non polarized; Library Reference: Capacitor - non polarized; Pin Count: 2; Status: Not Recommended; Manufacturer Part Number: CC0402_100NF_16V_10%_X7R; Case: 0402; Mounted: Yes; Socket: No; SMD: Yes; Manufacturer1 Example: PHYCOMP; Manufacturer1 ComponentHeight: 0.55mm; HelpURL: \\cern.ch\dfs\Applications\Altium\Datasheets\CC0402_X7R_PHYCOMP.pdf; Author: CERN DEM JLC; CreateDate: 12/3/2007; LatestRevisionDate: 12/3/2007
C68 C70 C75 C250 = CC0402_10NF_16V_10%_X7R: as C87 on sheet MB_fpga_power; Part Number: CC0402_10NF_16V_10%_X7R; Component Kind: Standard; Component Type: Standard; Designator: Capacitor - non polarized; Library Reference: Capacitor - non polarized; Pin Count: 2; Status: Not Recommended; Manufacturer Part Number: CC0402_10NF_16V_10%_X7R; Case: 0402; Mounted: Yes; Socket: No; SMD: Yes; Manufacturer1 Example: PHYCOMP; Manufacturer1 ComponentHeight: 0.55mm; HelpURL: \\cern.ch\dfs\Applications\Altium\Datasheets\CC0402_X7R_PHYCOMP.pdf; Author: CERN DEM JLC; CreateDate: 12/3/2007; LatestRevisionDate: 12/3/2007
C71 = CC0805_22uF_6.3V_20%_X5R: Non-polarised capacitor; Part Description: SMD Multilayer Chip Ceramic Capacitor; Manufacturer: GENERIC; Manufacturer1 Part Number: C0805C226M9PAC7800; Manufacturer1 Datasheet: \\cern.ch\dfs\Applications\Altium\Datasheets\CC1206_X5R_KEMET.pdf; Value: 22uF; Voltage: 6.3V; TC: X5R; Tolerance: ±20%; Table: Capacitors SMD; Part Number: CC0805_22uF_6.3V_20%_X5R; Component Kind: Standard; Component Type: Standard; Designator: Capacitor - non polarized; Library Reference: Capacitor - non polarized; Pin Count: 2; Status: Preferred; Manufacturer Part Number: CC0805_22uF_6.3V_20%_X5R; Case: 0805; Mounted: Yes; Socket: No; SMD: Yes; Manufacturer1 Example: KEMET; Manufacturer1 ComponentHeight: 1.45mm; HelpURL: \\cern.ch\dfs\Applications\Altium\Datasheets\CC1206_X5R_KEMET.pdf; Author: CERN DEM JLC; CreateDate: 12/3/2007; LatestRevisionDate: 12/3/2007
IC23 = TLK1221: Texas Instruments Gigabit Ethernet PHY with deterministic clocking and LVPECL output interface; RefId: 1576976; Value: TLK1221RHAT; Supplier: Farnell
L5 = Inductor: Ferrite bead; Published: 8-Jun-2000; Revision: July-2002: Re-released for DXP Platform.; Publisher: Altium Limited
R18 R63 = R0402_51R_1%_0.0625W_100PPM: Resistor - 1%; Part Description: General Purpose Thick Film Chip Resistor; Manufacturer: GENERIC; Manufacturer1 Part Number: 232270675109; Manufacturer1 Datasheet: \\cern.ch\dfs\Applications\Altium\Datasheets\R0402_Phycomp_RC0402.pdf; TC: ±100ppm/°C; Table: Resistors SMD; Part Number: R0402_51R_1%_0.0625W_100PPM; Component Kind: Standard; Component Type: Standard; Designator: Resistor - 1%; Library Reference: Resistor - 1%; Pin Count: 2; Value: 51; Status: Not recommended; Power: 0.0625W; Tolerance: ±1%; Manufacturer Part Number: R0402_51R_1%_0.0625W_100PPM; Case: 0402; Mounted: Yes; Socket: No; SMD: Yes; Manufacturer1 Example: PHYCOMP; Manufacturer1 ComponentHeight: 0.4mm; HelpURL: \\cern.ch\dfs\Applications\Altium\Datasheets\R0402_Phycomp_RC0402.pdf; Author: CERN DEM JLC; CreateDate: 12/3/2007; LatestRevisionDate: 3/13/2008
R65 = R0402_33R_1%_0.0625W_100PPM: as R39 on sheet MB_fpga_power; Part Number: R0402_33R_1%_0.0625W_100PPM; Component Kind: Standard; Component Type: Standard; Designator: Resistor - 1%; Library Reference: Resistor - 1%; Pin Count: 2; Value: 33; Status: Not recommended; Power: 0.0625W; Tolerance: ±1%; Manufacturer Part Number: R0402_33R_1%_0.0625W_100PPM; Case: 0402; Mounted: Yes; Socket: No; SMD: Yes; Manufacturer1 Example: PHYCOMP; Manufacturer1 ComponentHeight: 0.4mm; HelpURL: \\cern.ch\dfs\Applications\Altium\Datasheets\R0402_Phycomp_RC0402.pdf; Author: CERN DEM JLC; CreateDate: 12/3/2007; LatestRevisionDate: 3/13/2008

## Nets that join several sheets
+2V5: MB_main_FPGA (R99.2 R100.2), MB_fpga_power (66 pins)
+3V3: MB_CPU_io_ports (30 pins), MB_ZBT_memory (28 pins), MB_fpga_power (37 pins)
GND: MB_CPU_io_ports (49 pins), MB_main_FPGA (R102.1 R118.1), MB_ZBT_memory (27 pins), MB_fpga_power (199 pins), MB_downlink_phy (14 pins)